# Altium schematic sheet Vector_Mini_ST_1.SchDoc
size A4; SheetNumber: 1; SheetTotal: 2
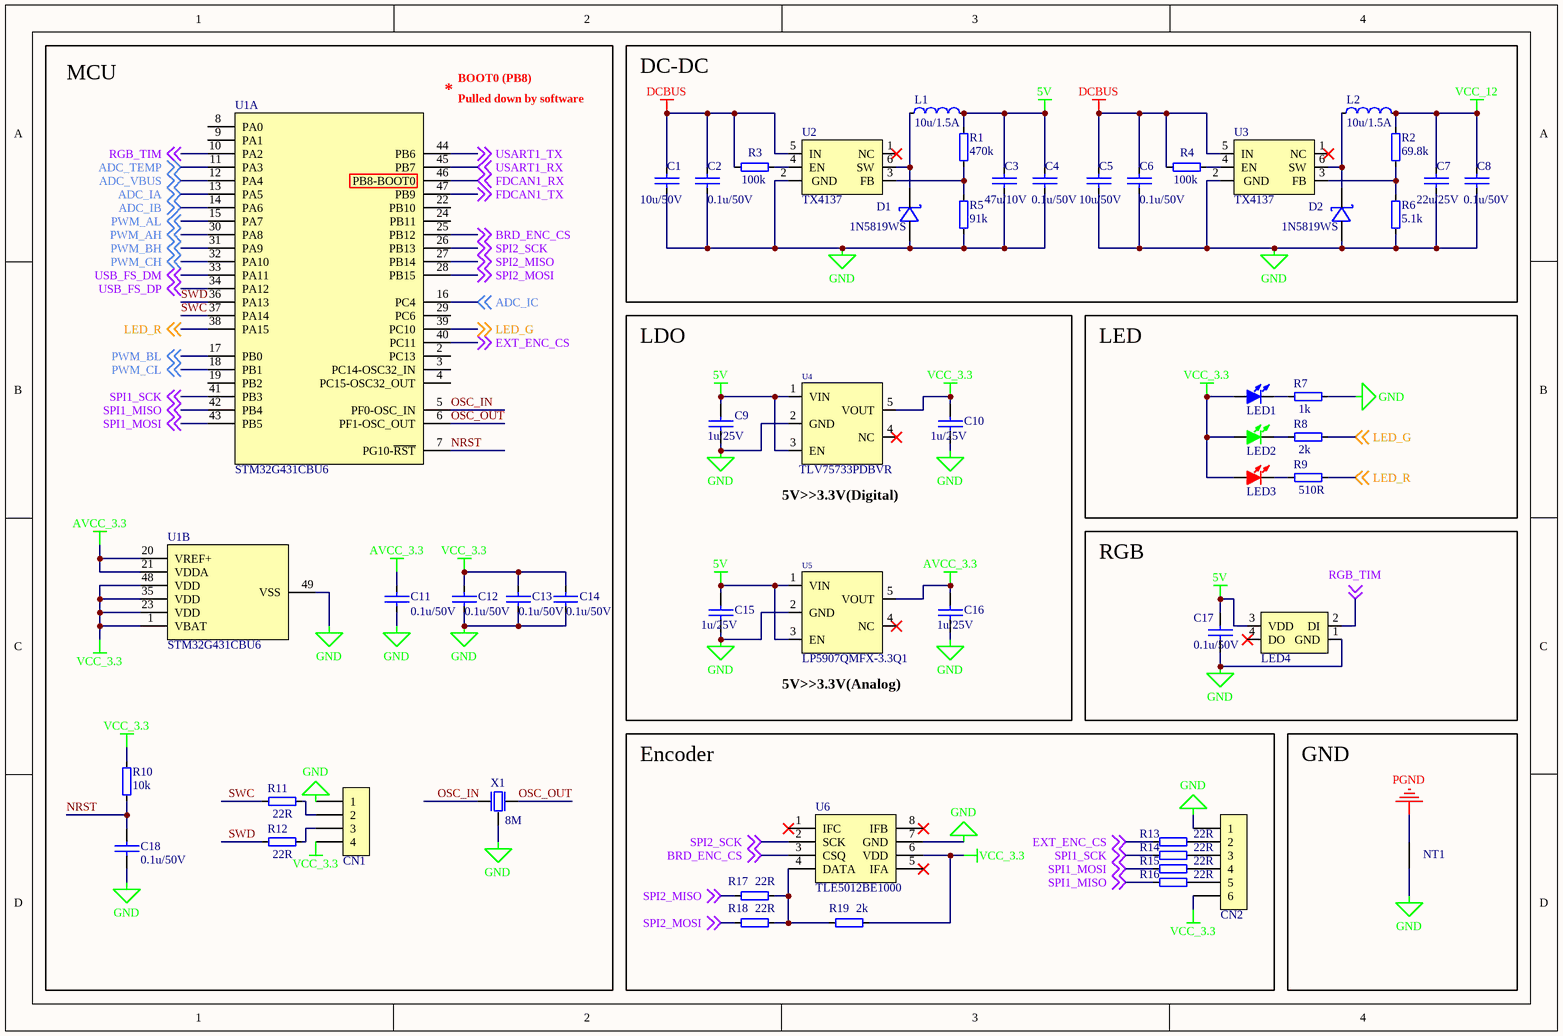
[diagram p0: Vector_Mini_ST_1.SchDoc]

## Parts
C1  10u/50V  [C1206_S]
C2  0.1u/50V  [C0603_S]
C3  47u/10V  [C1206_S]
C4  0.1u/50V  [C0603_S]
C5  10u/50V  [C1206_S]
C6  0.1u/50V  [C0603_S]
C7  22u/25V  [C1206_S]
C8  0.1u/50V  [C0603_S]
C9  1u/25V  [C0603_S]
C10  1u/25V  [C0603_S]
C11  0.1u/50V  [C0603_S]
C12  0.1u/50V  [C0603_S]
C13  0.1u/50V  [C0603_S]
C14  0.1u/50V  [C0603_S]
C15  1u/25V  [C0603_S]
C16  1u/25V  [C0603_S]
C17  0.1u/50V  [C0603_S]
C18  0.1u/50V  [C0603_S]
CN1  GH1.25-4P  [GH1.25-WS-4P]  (value not drawn)
CN2  GH1.25-6P  [GH1.25-WS-6P]  (value not drawn)
D1  1N5819WS  [SOD-323]
D2  1N5819WS  [SOD-323]
L1  10u/1.5A  [SMD-0420]
L2  10u/1.5A  [SMD-0420]
LED1  LED-0603-B  [LED-0603-B]  (value not drawn)
LED2  LED-0603-G  [LED-0603-G]  (value not drawn)
LED3  LED-0603-R  [LED-0603-R]  (value not drawn)
LED4  WS2812B-3528  [LED-3528-4P]  (value not drawn)
NT1  NetTie_30mil  [Nettie30mil]  (value not drawn)  (net tie, no BOM)
R1  470k  [R0603_S]
R2  69.8k  [R0603_S]
R3  100k  [R0603_S]
R4  100k  [R0603_S]
R5  91k  [R0603_S]
R6  5.1k  [R0603_S]
R7  1k  [R0603_S]
R8  2k  [R0603_S]
R9  510R  [R0603_S]
R10  10k  [R0603_S]
R11  22R  [R0603_S]
R12  22R  [R0603_S]
R13  22R  [R0603_S]
R14  22R  [R0603_S]
R15  22R  [R0603_S]
R16  22R  [R0603_S]
R17  22R  [R0603_S]
R18  22R  [R0603_S]
R19  2k  [R0603_S]
U1  STM32G431CBU6  [QFN-48]  (parts A,B of 2)
U2  TX4137  [SOT-23-6]
U3  TX4137  [SOT-23-6]
U4  TLV75733PDBVR  [SOT-23-5]
U5  LP5907QMFX-3.3Q1  [SOT-23-5]
U6  TLE5012BE1000  [SOP-8]
X1  8M  [OSC-3213-3P]

## Blocks framed on the sheet
MCU: C11-C14 C18 CN1 R10-R12 U1 X1
DC-DC: C1-C8 D1 D2 L1 L2 R1-R6 U2 U3
LDO: C9 C10 C15 C16 U4 U5
LED: LED1-LED3 R7-R9
RGB: C17 LED4
Encoder: CN2 R13-R19 U6
GND: NT1

## Nets
5V: C3.1 C4.1 C9.1 C15.1 C17.1 L1.2 LED4.3(VDD) R1.2 U4.1(VIN) U4.3(EN) U5.1(VIN) U5.3(EN)
AVCC_3.3: C11.1 C16.1 U1.20(VREF+) U1.21(VDDA) U5.5(VOUT)
DCBUS: C1.1 C2.1 C5.1 C6.1 R3.1 R4.1 U2.5(IN) U3.5(IN)
GND: C1.2 C2.2 C3.2 C4.2 C5.2 C6.2 C7.2 C8.2 C9.2 C10.2 C11.2 C12.2 C13.2 C14.2 C15.2 C16.2 C17.2 C18.1 CN1.1 CN2.1 D1.2(A) D2.2(A) LED4.1(GND) NT1.1 R5.1 R6.1 R7.2 U1.49(VSS) U2.2(GND) U3.2(GND) U4.2(GND) U5.2(GND) U6.7(GND) X1.2(GND)
PGND: NT1.2
VCC_3.3: C10.1 C12.1 C13.1 C14.1 CN1.4 CN2.6 LED1.1(A) LED2.1(A) LED3.1(A) R10.2 R19.2 U1.1(VBAT) U1.23(VDD) U1.35(VDD) U1.48(VDD) U4.5(VOUT) U6.6(VDD)
VCC_12: C7.1 C8.1 L2.2 R2.2
ADC_IA: U1.13(PA5) ; off-sheet ADC_IA
ADC_IB: U1.14(PA6) ; off-sheet ADC_IB
ADC_IC: U1.16(PC4) ; off-sheet ADC_IC
ADC_TEMP: U1.11(PA3) ; off-sheet ADC_TEMP
ADC_VBUS: U1.12(PA4) ; off-sheet ADC_VBUS
BRD_ENC_CS: U1.25(PB12) U6.3(CSQ) ; off-sheet BRD_ENC_CS
EXT_ENC_CS: R13.1 U1.40(PC11) ; off-sheet EXT_ENC_CS
FDCAN1_RX: U1.46(PB8-BOOT0) ; off-sheet FDCAN1_RX
FDCAN1_TX: U1.47(PB9) ; off-sheet FDCAN1_TX
LED_G: R8.2 U1.39(PC10) ; off-sheet LED_G
LED_R: R9.2 U1.38(PA15) ; off-sheet LED_R
NRST: C18.2 R10.1 U1.7(PG10-~{RST})
OSC_IN: U1.5(PF0-OSC_IN) X1.3(OSC2)
OSC_OUT: U1.6(PF1-OSC_OUT) X1.1(OSC1)
PWM_AH: U1.30(PA8) ; off-sheet PWM_AH
PWM_AL: U1.15(PA7) ; off-sheet PWM_AL
PWM_BH: U1.31(PA9) ; off-sheet PWM_BH
PWM_BL: U1.17(PB0) ; off-sheet PWM_BL
PWM_CH: U1.32(PA10) ; off-sheet PWM_CH
PWM_CL: U1.18(PB1) ; off-sheet PWM_CL
RGB_TIM: LED4.2(DI) U1.10(PA2) ; off-sheet RGB_TIM
SPI1_MISO: R16.1 U1.42(PB4) ; off-sheet SPI1_MISO
SPI1_MOSI: R15.1 U1.43(PB5) ; off-sheet SPI1_MOSI
SPI1_SCK: R14.1 U1.41(PB3) ; off-sheet SPI1_SCK
SPI2_MISO: R17.1 U1.27(PB14) ; off-sheet SPI2_MISO
SPI2_MOSI: R18.1 U1.28(PB15) ; off-sheet SPI2_MOSI
SPI2_SCK: U1.26(PB13) U6.2(SCK) ; off-sheet SPI2_SCK
SWC: R11.1 U1.37(PA14)
SWD: R12.1 U1.36(PA13)
USART1_RX: U1.45(PB7) ; off-sheet USART1_RX
USART1_TX: U1.44(PB6) ; off-sheet USART1_TX
USB_FS_DM: U1.33(PA11) ; off-sheet USB_FS_DM
USB_FS_DP: U1.34(PA12) ; off-sheet USB_FS_DP
NetCN1_2: CN1.2 R11.2
NetCN1_3: CN1.3 R12.2
NetCN2_2: CN2.2 R13.2
NetCN2_3: CN2.3 R14.2
NetCN2_4: CN2.4 R15.2
NetCN2_5: CN2.5 R16.2
NetD1_1: D1.1(K) L1.1 U2.6(SW)
NetD2_1: D2.1(K) L2.1 U3.6(SW)
NetLED1_2: LED1.2(K) R7.1
NetLED2_2: LED2.2(K) R8.1
NetLED3_2: LED3.2(K) R9.1
NetR1_1: R1.1 R5.2 U2.3(FB)
NetR2_1: R2.1 R6.2 U3.3(FB)
NetR3_2: R3.2 U2.4(EN)
NetR4_2: R4.2 U3.4(EN)
NetR17_2: R17.2 R18.2 R19.1 U6.4(DATA)

Not connected (* = marked no-connect by the designer): LED4 4(DO)*; U1 2(PC13) 3(PC14-OSC32_IN) 4(PC15-OSC32_OUT) 8(PA0) 9(PA1) 19(PB2) 22(PB10) 24(PB11) 29(PC6); U2 1(NC)*; U3 1(NC)*; U4 4(NC)*; U5 4(NC)*; U6 1(IFC)* 5(IFA)* 8(IFB)*

## Notes on the sheet
- (near U1) *
- (near U1) BOOT0 (PB8)
- (near U1) Pulled down by software
- (near U4) 5V>>3.3V(Digital)
- (near U5) 5V>>3.3V(Analog)

## Library data of the parts
C1-C10 C15-C18 = CAP: 贴片电容
C11-C14 = C0603: 0603贴片电容
D1 D2 = 1N5819WS: 肖特基二极管; Manufacturer: Hottech(合科泰); Device: 1N5819WS_C191023; Add into BOM: yes; Forward Voltage (Vf@If): 600mV@1A; Reverse Voltage (Vr): 40V; Average Rectified Current (Io): 1A; Symbol: 1N5819WS; Supplier: LCSC; Supplier Part: C191023; Manufacturer Part: 1N5819WS; JLCPCB Part Class: 基础库; LCSC Part Name: 电压:40V 电流:1A; Supplier Footprint: SOD-323; Datasheet: https://atta.szlcsc.com/upload/public/pdf/source/20220428/3CB86FD8D28D653594B4E35F9D5AEFD9.pdf; Convert to PCB: yes
L1 L2 = IND: 功率电感
LED4 = WS2812B-3528: Manufacturer: XINGLIGHT(成兴光); Symbol: XL-3528RGBW-WS2812B; Add into BOM: yes; Emitted Color: RGB三色; Dominant Wavelength: 618nm~623nm；520nm~525nm；467nm~472nm; Peak Wavelength: 525nm；623nm；472nm; Forward Current: 20mA; Power Dissipation: 50mW；50mW；45mW; Viewing Angle: 120°; Mounting Sytle: 正贴; Device: XL-3528RGBW-WS2812B; LCSC Part Name: RGB三色 正贴 幻彩; Supplier Part: C2890364; Manufacturer Part: XL-3528RGBW-WS2812B; Supplier Footprint: SMD3528-4P; JLCPCB Part Class: 扩展库; Datasheet: https://atta.szlcsc.com/upload/public/pdf/source/20221102/50F456983F591359B0D81AA557777463.pdf; Supplier: LCSC; Convert to PCB: yes; Diode Configuration: -; Operating Temperature: -25℃~+80℃
R1-R19 = RES: 贴片电阻
U1 = STM32G431CBU6: MF: {'manufacturer': u'STMicroelectronics'}; MP: STM32G474RET6; Package: None; Price: None; Value: *; Availability: Unavailable
U2 U3 = TX4137: 60V Buck
U4 = TLV75733PDBVR: Manufacturer: RICHTEK(立锜); Symbol: RT9013-33GB; Add into BOM: yes; Output Type: 固定; Output Polarity: 正; Number of Outputs: 1; Maximum Input Voltage: 5.5V; Output Voltage: 3.3V; Dropout Voltage: 400mV@(500mA); Quiescent Current (Ground Current): 50uA; Output Current: 500mA; Power Supply Rejection Ratio (PSRR): 50dB@(10kHz); Device: RT9013-33GB; LCSC Part Name: 输入5.5V 输出3.3V 500mA; Supplier Part: C47773; Manufacturer Part: RT9013-33GB; Supplier Footprint: SOT-23-5; JLCPCB Part Class: 扩展库; Datasheet: https://atta.szlcsc.com/upload/public/pdf/source/20150504/1457707282459.pdf; Supplier: LCSC; Convert to PCB: yes; Noise: -; Feature: -; Operating Temperature: -40℃~+85℃
U5 = LP5907MFX-3.3: Manufacturer: RICHTEK(立锜); Symbol: RT9013-33GB; Add into BOM: yes; Output Type: 固定; Output Polarity: 正; Number of Outputs: 1; Maximum Input Voltage: 5.5V; Output Voltage: 3.3V; Dropout Voltage: 400mV@(500mA); Quiescent Current (Ground Current): 50uA; Output Current: 500mA; Power Supply Rejection Ratio (PSRR): 50dB@(10kHz); Device: RT9013-33GB; LCSC Part Name: 输入5.5V 输出3.3V 500mA; Supplier Part: C47773; Manufacturer Part: RT9013-33GB; Supplier Footprint: SOT-23-5; JLCPCB Part Class: 扩展库; Datasheet: https://atta.szlcsc.com/upload/public/pdf/source/20150504/1457707282459.pdf; Supplier: LCSC; Convert to PCB: yes; Noise: -; Feature: -; Operating Temperature: -40℃~+85℃
U6 = TLE5012BE1000: Manufacturer: Infineon(英飞凌); Symbol: TLE5012BE1000XUMA1; Add into BOM: yes; Rotation Angle: 0°~360°; Device: TLE5012BE1000; LCSC Part Name: TLE5012BE1000; Supplier Part: C123083; Manufacturer Part: TLE5012BE1000; Supplier Footprint: SO-8; JLCPCB Part Class: 扩展库; Datasheet: https://atta.szlcsc.com/upload/public/pdf/source/20170728/C123083_1501225763065848823.pdf; Supplier: LCSC; Convert to PCB: yes
X1 = OSC-3213: 无源晶振